# Altium schematic sheet USB Power.SchDoc
size A4; SheetNumber: 3; SheetTotal: 5
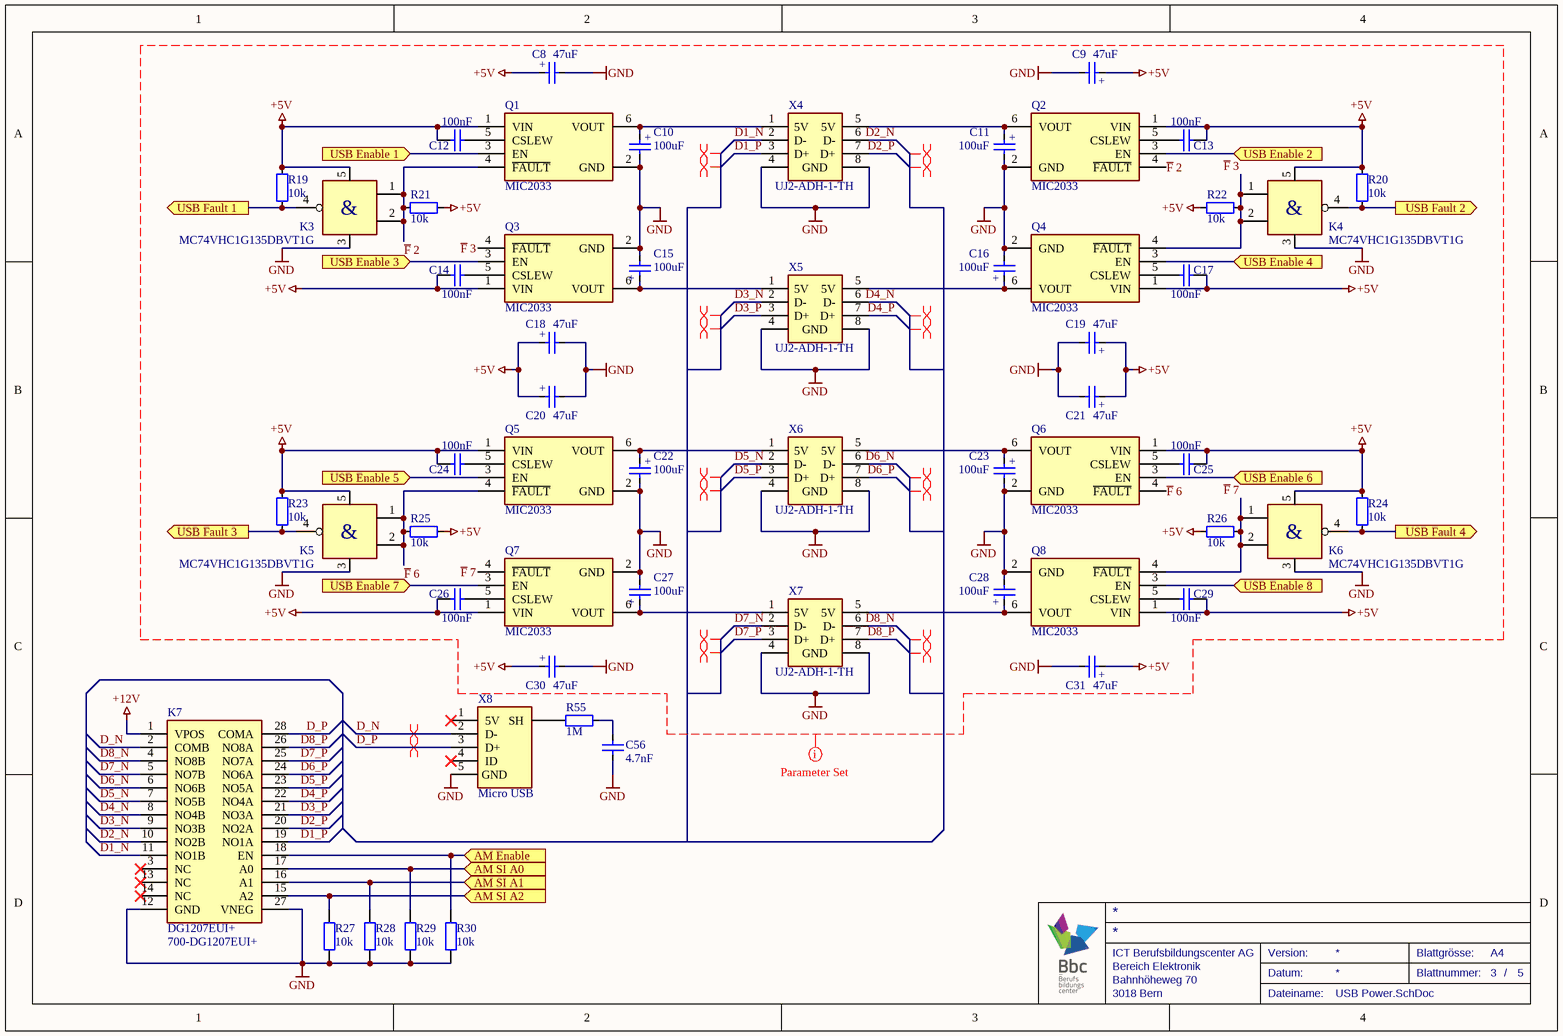
[diagram p0: USB Power.SchDoc]

## Parts
C8  value 47uF  [T58W9476M6R3C0300]  (hidden comment: Capacitor P)
C9  value 47uF  [T58W9476M6R3C0300]  (hidden comment: Capacitor P)
C10  value 100uF  [CAP TAN A H]  (hidden comment: Capacitor P)
C11  value 100uF  [CAP TAN A H]  (hidden comment: Capacitor P)
C12  value 100nF  [CAP CER 0805 R]  (hidden comment: Capacitor)
C13  value 100nF  [CAP CER 0805 R]  (hidden comment: Capacitor)
C14  value 100nF  [CAP CER 0805 R]  (hidden comment: Capacitor)
C15  value 100uF  [CAP TAN A H]  (hidden comment: Capacitor P)
C16  value 100uF  [CAP TAN A H]  (hidden comment: Capacitor P)
C17  value 100nF  [CAP CER 0805 R]  (hidden comment: Capacitor)
C18  value 47uF  [T58W9476M6R3C0300]  (hidden comment: Capacitor P)
C19  value 47uF  [T58W9476M6R3C0300]  (hidden comment: Capacitor P)
C20  value 47uF  [T58W9476M6R3C0300]  (hidden comment: Capacitor P)
C21  value 47uF  [T58W9476M6R3C0300]  (hidden comment: Capacitor P)
C22  value 100uF  [CAP TAN A H]  (hidden comment: Capacitor P)
C23  value 100uF  [CAP TAN A H]  (hidden comment: Capacitor P)
C24  value 100nF  [CAP CER 0805 R]  (hidden comment: Capacitor)
C25  value 100nF  [CAP CER 0805 R]  (hidden comment: Capacitor)
C26  value 100nF  [CAP CER 0805 R]  (hidden comment: Capacitor)
C27  value 100uF  [CAP TAN A H]  (hidden comment: Capacitor P)
C28  value 100uF  [CAP TAN A H]  (hidden comment: Capacitor P)
C29  value 100nF  [CAP CER 0805 R]  (hidden comment: Capacitor)
C30  value 47uF  [T58W9476M6R3C0300]  (hidden comment: Capacitor P)
C31  value 47uF  [T58W9476M6R3C0300]  (hidden comment: Capacitor P)
C56  value 4.7nF  [CAP CER 0805 R]  (hidden comment: Capacitor)
K3  MC74VHC1G135DBVT1G  [SOT95P275X110-5N]
K4  MC74VHC1G135DBVT1G  [SOT95P275X110-5N]
K5  MC74VHC1G135DBVT1G  [SOT95P275X110-5N]
K6  MC74VHC1G135DBVT1G  [SOT95P275X110-5N]
K7  DG1207EUI+  Supplier Part Number 1: 700-DG1207EUI+  [TSOP65P640X100-28N]
Q1  MIC2033  [SOT-23-6L]
Q2  MIC2033  [SOT-23-6L]
Q3  MIC2033  [SOT-23-6L]
Q4  MIC2033  [SOT-23-6L]
Q5  MIC2033  [SOT-23-6L]
Q6  MIC2033  [SOT-23-6L]
Q7  MIC2033  [SOT-23-6L]
Q8  MIC2033  [SOT-23-6L]
R19  value 10k  [RES 0805 R]  (hidden comment: Resistor)
R20  value 10k  [RES 0805 R]  (hidden comment: Resistor)
R21  value 10k  [RES 0805 R]  (hidden comment: Resistor)
R22  value 10k  [RES 0805 R]  (hidden comment: Resistor)
R23  value 10k  [RES 0805 R]  (hidden comment: Resistor)
R24  value 10k  [RES 0805 R]  (hidden comment: Resistor)
R25  value 10k  [RES 0805 R]  (hidden comment: Resistor)
R26  value 10k  [RES 0805 R]  (hidden comment: Resistor)
R27  value 10k  [RES 0805 R]  (hidden comment: Resistor)
R28  value 10k  [RES 0805 R]  (hidden comment: Resistor)
R29  value 10k  [RES 0805 R]  (hidden comment: Resistor)
R30  value 10k  [RES 0805 R]  (hidden comment: Resistor)
R55  value 1M  [RES 0805 R]  (hidden comment: Resistor)
X4  UJ2-ADH-1-TH  [UJ2-ADH-1-TH]
X5  UJ2-ADH-1-TH  [UJ2-ADH-1-TH]
X6  UJ2-ADH-1-TH  [UJ2-ADH-1-TH]
X7  UJ2-ADH-1-TH  [UJ2-ADH-1-TH]
X8  Micro USB  [UJ2-MIBH-4-SMT-TR]

## Ports
AM Enable (in), AM SI A0 (in), AM SI A1 (in), AM SI A2 (in), USB Enable 1 (in), USB Enable 2 (in), USB Enable 3 (in), USB Enable 4 (in), USB Enable 5 (in), USB Enable 6 (in), USB Enable 7 (in), USB Enable 8 (in), USB Fault 1 (out), USB Fault 2 (out), USB Fault 3 (out), USB Fault 4 (out)

## Nets
+5V: C8.A(Anode) C9.A(Anode) C12.1 C13.1 C14.1 C17.1 C18.A(Anode) C19.A(Anode) C20.A(Anode) C21.A(Anode) C24.1 C25.1 C26.1 C29.1 C30.A(Anode) C31.A(Anode) K3.5(VCC) K4.5(VCC) K5.5(VCC) K6.5(VCC) Q1.1(VIN) Q2.1(VIN) Q3.1(VIN) Q4.1(VIN) Q5.1(VIN) Q6.1(VIN) Q7.1(VIN) Q8.1(VIN) R19.1 R20.1 R21.1 R22.1 R23.1 R24.1 R25.1 R26.1
+12V: K7.1(VPOS)
GND: C8.C(Cathode) C9.C(Cathode) C10.C(Cathode) C11.C(Cathode) C15.C(Cathode) C16.C(Cathode) C18.C(Cathode) C19.C(Cathode) C20.C(Cathode) C21.C(Cathode) C22.C(Cathode) C23.C(Cathode) C27.C(Cathode) C28.C(Cathode) C30.C(Cathode) C31.C(Cathode) C56.1 K3.3(GND) K4.3(GND) K5.3(GND) K6.3(GND) K7.12(GND) K7.27(VNEG) Q1.2(GND) Q2.2(GND) Q3.2(GND) Q4.2(GND) Q5.2(GND) Q6.2(GND) Q7.2(GND) Q8.2(GND) R27.1 R28.1 R29.1 R30.1 X4.4(GND) X4.8(GND) X5.4(GND) X5.8(GND) X6.4(GND) X6.8(GND) X7.4(GND) X7.8(GND) X8.5(GND)
AM Enable: K7.18(EN) R30.2 ; port AM Enable
AM SI A0: K7.17(A0) R29.2 ; port AM SI A0
AM SI A1: K7.16(A1) R28.2 ; port AM SI A1
AM SI A2: K7.15(A2) R27.2 ; port AM SI A2
D1_N: K7.11(NO1B) X4.2(D-)
D1_P: K7.19(NO1A) X4.3(D+)
D2_N: K7.10(NO2B) X4.6(D-)
D2_P: K7.20(NO2A) X4.7(D+)
D3_N: K7.9(NO3B) X5.2(D-)
D3_P: K7.21(NO3A) X5.3(D+)
D4_N: K7.8(NO4B) X5.6(D-)
D4_P: K7.22(NO4A) X5.7(D+)
D5_N: K7.7(NO5B) X6.2(D-)
D5_P: K7.23(NO5A) X6.3(D+)
D6_N: K7.6(NO6B) X6.6(D-)
D6_P: K7.24(NO6A) X6.7(D+)
D7_N: K7.5(NO7B) X7.2(D-)
D7_P: K7.25(NO7A) X7.3(D+)
D8_N: K7.4(NO8B) X7.6(D-)
D8_P: K7.26(NO8A) X7.7(D+)
D_N: K7.2(COMB) X8.2(D-)
D_P: K7.28(COMA) X8.3(D+)
~{F} 2: K3.1(A) K3.2(B) Q1.4(~{FAULT}) Q2.4(~{FAULT}) R21.2
~{F} 3: K4.1(A) K4.2(B) Q3.4(~{FAULT}) Q4.4(~{FAULT}) R22.2
~{F} 6: K5.1(A) K5.2(B) Q5.4(~{FAULT}) Q6.4(~{FAULT}) R25.2
~{F} 7: K6.1(A) K6.2(B) Q7.4(~{FAULT}) Q8.4(~{FAULT}) R26.2
USB Enable 1: Q1.3(EN) ; port USB Enable 1
USB Enable 2: Q2.3(EN) ; port USB Enable 2
USB Enable 3: Q3.3(EN) ; port USB Enable 3
USB Enable 4: Q4.3(EN) ; port USB Enable 4
USB Enable 5: Q5.3(EN) ; port USB Enable 5
USB Enable 6: Q6.3(EN) ; port USB Enable 6
USB Enable 7: Q7.3(EN) ; port USB Enable 7
USB Enable 8: Q8.3(EN) ; port USB Enable 8
USB Fault 1: K3.4(Y) R19.2 ; port USB Fault 1
USB Fault 2: K4.4(Y) R20.2 ; port USB Fault 2
USB Fault 3: K5.4(Y) R23.2 ; port USB Fault 3
USB Fault 4: K6.4(Y) R24.2 ; port USB Fault 4
NetC10_A: C10.A(Anode) Q1.6(VOUT) X4.1(5V)
NetC11_A: C11.A(Anode) Q2.6(VOUT) X4.5(5V)
NetC12_2: C12.2 Q1.5(CSLEW)
NetC13_2: C13.2 Q2.5(CSLEW)
NetC14_2: C14.2 Q3.5(CSLEW)
NetC15_A: C15.A(Anode) Q3.6(VOUT) X5.1(5V)
NetC16_A: C16.A(Anode) Q4.6(VOUT) X5.5(5V)
NetC17_2: C17.2 Q4.5(CSLEW)
NetC22_A: C22.A(Anode) Q5.6(VOUT) X6.1(5V)
NetC23_A: C23.A(Anode) Q6.6(VOUT) X6.5(5V)
NetC24_2: C24.2 Q5.5(CSLEW)
NetC25_2: C25.2 Q6.5(CSLEW)
NetC26_2: C26.2 Q7.5(CSLEW)
NetC27_A: C27.A(Anode) Q7.6(VOUT) X7.1(5V)
NetC28_A: C28.A(Anode) Q8.6(VOUT) X7.5(5V)
NetC29_2: C29.2 Q8.5(CSLEW)
NetC56_2: C56.2 R55.1
NetR55_2: R55.2 X8.SH

Not connected (* = marked no-connect by the designer): K7 3(NC)* 13(NC)* 14(NC)*; X8 1(5V)* 4(ID)*

## Layout directives
differential pair: +5V, D1_N, D1_P, D2_N, D2_P, D3_N, D3_P, D4_N, D4_P, D5_N, D5_P, D6_N, D6_P, D7_N, D7_P, D8_N, D8_P, D_N, D_P, GND, ~{F} 2, ~{F} 3, ~{F} 6, ~{F} 7

## Notes on the sheet
- Bahnhöheweg 70
- ICT Berufsbildungscenter AG
- Bereich Elektronik
- Datum:
- Version:
- Blattgrösse:
- Blattnummer:
- A4
- /
- 3018 Bern
- Dateiname:
- (in symbol Capacitor P) +
- (in symbol MC74VHC1G135DBVT1G) &

## Library data of the parts
C8-C11 C15 C16 C18-C23 C27 C28 C30 C31 = Capacitor P: Polarized Capacitor; LatestRevisionDate: 02.04.2019; Publisher: ICT Berufsbildungscenter AG
C12-C14 C17 C24-C26 C29 C56 = Capacitor: Non polarized capacitor; LatestRevisionDate: 01.04.2019; Publisher: ICT Berufsbildungscenter AG
K7 = DG1207EUI+: Analog Switch ICs; Manufacturer_Name: Maxim Integrated; Datasheet Link: https://datasheets.maximintegrated.com/en/ds/DG1206-DG1207.pdf; Height: 1.1mm; Manufacturer_Part_Number: DG1207EUI+; Mouser Part Number: 700-DG1207EUI+; Mouser Price/Stock: https://www.mouser.co.uk/ProductDetail/Maxim-Integrated/DG1207EUI%2b?qs=DPoM0jnrROX2%252BoIpSyCc8Q%3D%3D; ComponentLink1Description: New link; ComponentLink1URL: https://www.mouser.ch/ProductDetail/Maxim-Integrated/DG1207EUI%2b?qs=DPoM0jnrROX2%252BoIpSyCc8Q%3D%3D; Supplier 1: Mouser
X4-X7 = UJ2-ADH-1-TH: USB Type A; Manufacturer_Name: CUI Inc.; Datasheet Link: http://www.cui.com/product/resource/uj2-adh-th.pdf; Manufacturer_Part_Number: UJ2-ADH-1-TH; Mouser Part Number: 490-UJ2-ADH-1-TH; Mouser Price/Stock: https://www.mouser.co.uk/ProductDetail/CUI-Devices/UJ2-ADH-1-TH/?qs=5mqXD9RfOg1bQeR60A16hA%3D%3D; Arrow Part Number: UJ2-ADH-1-TH; Arrow Price/Stock: https://www.arrow.com/en/products/uj2-adh-1-th/cui-devices
X8 = Micro USB: board to board header; LatestRevisionDate: 02.05.2019; Publisher: ICT Berufsbildungscenter AG
Q1-Q8 = MIC2033: ComponentLink1Description: New link; ComponentLink1URL: https://www.mouser.ch/ProductDetail/Microchip-Technology-Micrel/MIC2033-10AYM6-TR?qs=Y3Q3JoKAO1RvbLJdilrfXQ%3D%3D
R19-R30 R55 = Resistor: LatestRevisionDate: 02.04.2019; Publisher: ICT Berufsbildungscenter AG